# Altium schematic sheet SCH_07_Output.SchDoc
size A4; DrawnBy: Phung Nhat Minh; SheetNumber: 7; SheetTotal: 7
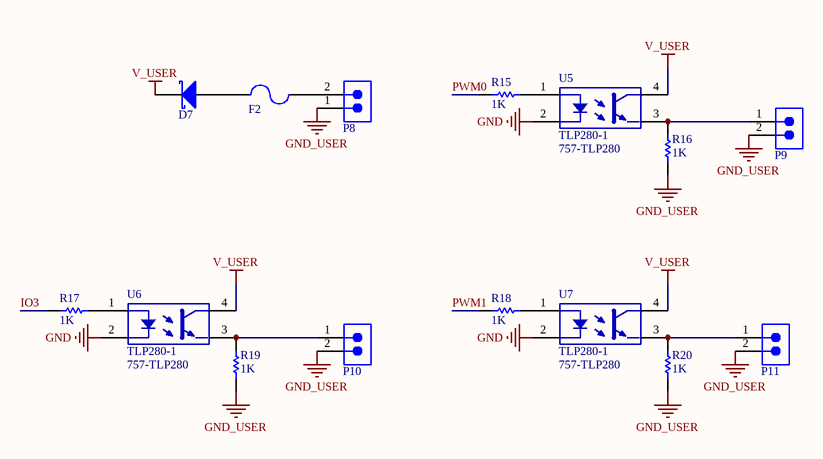
[diagram p0: SCH_07_Output.SchDoc]

## Parts
D7  D Schottky  [SS34]  (value not drawn)
F2  Fuse  [FUSE SMD]  (value not drawn)
P8  691312510002  [691312510002]  (value not drawn)
P9  691312510002  [691312510002]  (value not drawn)
P10  691312510002  [691312510002]  (value not drawn)
P11  691312510002  [691312510002]  (value not drawn)
R15  value 1K  [RES-SM-0603]  (hidden comment: RESISTOR SMD)
R16  value 1K  [RES-SM-0603]  (hidden comment: RESISTOR SMD)
R17  value 1K  [RES-SM-0603]  (hidden comment: RESISTOR SMD)
R18  value 1K  [RES-SM-0603]  (hidden comment: RESISTOR SMD)
R19  value 1K  [RES-SM-0603]  (hidden comment: RESISTOR SMD)
R20  value 1K  [RES-SM-0603]  (hidden comment: RESISTOR SMD)
U5  TLP280-1  Supplier Part Number 1: 757-TLP280  [SOIC127P700X240-4N]
U6  TLP280-1  Supplier Part Number 1: 757-TLP280  [SOIC127P700X240-4N]
U7  TLP280-1  Supplier Part Number 1: 757-TLP280  [SOIC127P700X240-4N]

## Nets
GND: U5.2 U6.2 U7.2
GND_USER: P8.1 P9.2 P10.2 P11.2 R16.1 R19.1 R20.1
V_USER: D7.2(K) U5.4 U6.4 U7.4
IO3: R17.2
PWM0: R15.2
PWM1: R18.2
NetD7_1: D7.1(A) F2.1
NetF2_2: F2.2 P8.2
NetP9_1: P9.1 R16.2 U5.3
NetP10_1: P10.1 R19.2 U6.3
NetP11_1: P11.1 R20.2 U7.3
NetR15_1: R15.1 U5.1
NetR17_1: R17.1 U6.1
NetR18_1: R18.1 U7.1

## Notes on the sheet
- Title
- Size
- Date:
- A4
- Number
- Revision
- Time:
- Drawn By:
- Checked By:

## Library data of the parts
D7 = D Schottky: Schottky Diode; Published: 8-Jun-2000; LatestRevisionDate: 17-Jul-2002; LatestRevisionNote: Re-released for DXP Platform.; PackageReference: SMB; Publisher: Altium Limited; PackageDescription: DO-214-AA/SMB; 2 C-Bend Leads; Body 5.3 x 3.6 mm, inc. leads (LxW); Code_JEDEC: DO-214-AA
P8-P11 = 691312510002: WR-TBL Series 312 Open Horizontal PCB Header, THT, pitch 5.08mm, 2p; Manufacturer: Wurth Elektronik; Modularity: No; Rated Current: 20A; Working Voltage: 300V; ComponentLink1Description: Website Link; ComponentLink1URL: https://www.we-online.com/redexpert/article/691312510002?ad; ComponentLink2Description: Datasheet Link; ComponentLink2URL: https://www.we-online.com/redexpert/spec/691312510002?ad; Manufacturer Part Number: 691312510002; Category: Terminal Blocks; Match Code: WR-TBL; Mount: Through Hole; Operating Temperature Max: 105°C; Operating Temperature Min: -40°C; Packaging: Box; Application: Pluggable; Number of Pins: 2; Number of Rows: 1; Orientation: Horizontal; Pitch: 5.08mm
R15-R20 = RESISTOR SMD: Resistor
U5-U7 = TLP280-1: Transistor Output Optocouplers 80Vceo 2500Vrms AC input; Supplier 1: Mouser